# Altium project COM.PrjPcb (part 1 of 2)
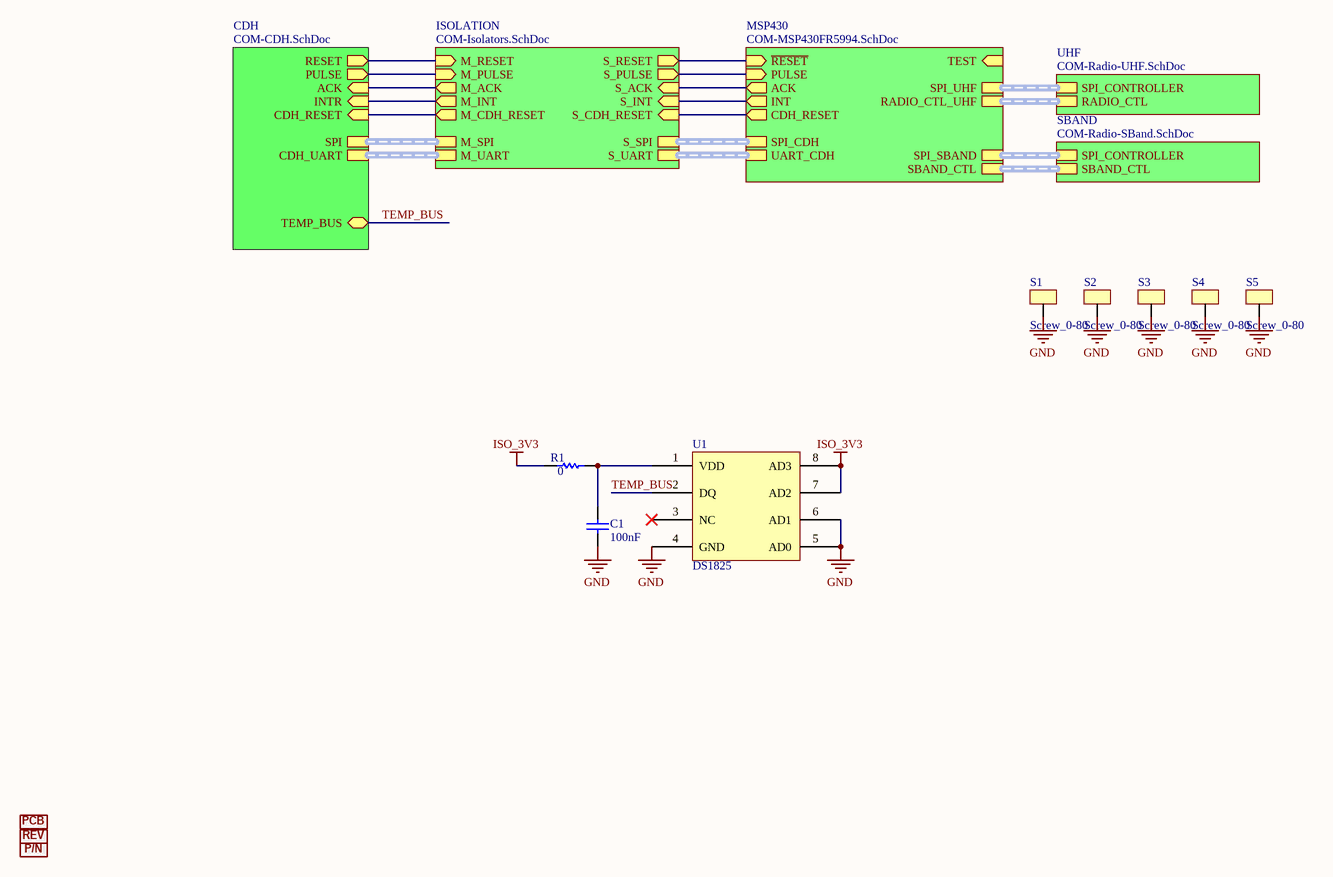
[diagram p0: COM-TopLevel.SchDoc]
BoardName: Cesium 3; Date: June 22nd, 2018; Engineer: Radio Jesus; PartNumber: Ce-137; Revision: A; Version: 1.0
6 sheets, 167 parts. Net scope: hierarchical (ports join the sheet entries above them; power ports are global).
Board file: COM.PcbDoc
Sheets:
  COM-TopLevel.SchDoc
    CDH = COM-CDH.SchDoc
    ISOLATION = COM-Isolators.SchDoc
    SBAND = COM-Radio-SBand.SchDoc
    UHF = COM-Radio-UHF.SchDoc
    MSP430 = COM-MSP430FR5994.SchDoc

## Sheet COM-TopLevel.SchDoc: Top Level
size B; Date: June 22nd, 2018; CompanyName: Lockheed Martin; Engineer: Radio Jesus; Organization: Colorado Space Grant; DocumentNumber: 1; Revision: A; SheetNumber: 1; SheetTotal: 7; ProjectName: COM_Digital.prjpcb

### Parts
C1  Capacitance: 100nF  [1608[0603]]  (hidden comment: C0603C104J3RACAUTO)
INFO1  Info_Board  [Info_Board]  (value not drawn)  (no BOM)
INFO2  Info_Revision  [Info_Revision]  (value not drawn)  (no BOM)
INFO3  Info_PartNumber  [Info_PartNumber]  (value not drawn)  (no BOM)
R1  Resistance: 0  [1608[0603]]  (hidden comment: CRCW06030000Z0EAC)
S1  Screw_0-80  [Screw_0-80]
S2  Screw_0-80  [Screw_0-80]
S3  Screw_0-80  [Screw_0-80]
S4  Screw_0-80  [Screw_0-80]
S5  Screw_0-80  [Screw_0-80]
U1  DS1825  [DS1825]

### Sub-sheets
CDH = COM-CDH.SchDoc: SPI (harness SPI), ACK (in), PULSE (out), CDH_RESET (in), RESET (out), INTR (in), TEMP_BUS (bidir), CDH_UART (harness UART)
ISOLATION = COM-Isolators.SchDoc: M_PULSE (in), M_ACK (out), S_ACK (in), S_PULSE (out), M_SPI (harness SPI_CDH), S_SPI (harness SPI_CDH), M_RESET (in), M_INT (out), S_RESET (out), S_INT (in), M_CDH_RESET (out), S_CDH_RESET (in), M_UART (harness UART), S_UART (harness UART)
MSP430 = COM-MSP430FR5994.SchDoc: UART_CDH (harness UART), SPI_CDH (harness SPI), ACK (out), PULSE (in), INT (out), CDH_RESET (out), SPI_UHF (harness SPI), SPI_SBAND (harness SPI), ~{RESET} (in), TEST (in), RADIO_CTL_UHF (harness UHF_CTL), SBAND_CTL (harness SBAND_CTL)
SBAND = COM-Radio-SBand.SchDoc: SPI_CONTROLLER (harness SPI), SBAND_CTL (harness SBAND_CTL)
UHF = COM-Radio-UHF.SchDoc: SPI_CONTROLLER (harness SPI), RADIO_CTL (harness UHF_CTL)

### Nets
GND: C1.2 S1.1 S2.1 S3.1 S4.1 S5.1 U1.4(GND) U1.5(AD0) U1.6(AD1)
ISO_3V3: R1.1 U1.7(AD2) U1.8(AD3)
M_ACK: sheet CDH/ACK, sheet ISOLATION/M_ACK
M_CDH_RESET: sheet CDH/CDH_RESET, sheet ISOLATION/M_CDH_RESET
M_INT: sheet CDH/INTR, sheet ISOLATION/M_INT
M_PULSE: sheet CDH/PULSE, sheet ISOLATION/M_PULSE
M_RESET: sheet CDH/RESET, sheet ISOLATION/M_RESET
~{RESET}: sheet ISOLATION/S_RESET, sheet MSP430/~{RESET}
S_ACK: sheet ISOLATION/S_ACK, sheet MSP430/ACK
S_CDH_RESET: sheet ISOLATION/S_CDH_RESET, sheet MSP430/CDH_RESET
S_INT: sheet ISOLATION/S_INT, sheet MSP430/INT
S_PULSE: sheet ISOLATION/S_PULSE, sheet MSP430/PULSE
TEMP_BUS: U1.2(DQ) ; sheet CDH/TEMP_BUS
NetC1_1: C1.1 R1.2 U1.1(VDD)

Not connected (* = marked no-connect by the designer): U1 3(NC)*

### Buses and harness runs
harness sheet CDH/CDH_UART = sheet ISOLATION/M_UART
harness sheet CDH/SPI = sheet ISOLATION/M_SPI
harness sheet ISOLATION/S_SPI = sheet MSP430/SPI_CDH
harness sheet ISOLATION/S_UART = sheet MSP430/UART_CDH
harness sheet MSP430/RADIO_CTL_UHF = sheet UHF/RADIO_CTL
harness sheet MSP430/SBAND_CTL = sheet SBAND/SBAND_CTL
harness sheet MSP430/SPI_SBAND = sheet SBAND/SPI_CONTROLLER
harness sheet MSP430/SPI_UHF = sheet UHF/SPI_CONTROLLER

### Notes on the sheet
- Title
- Board
- Date
- Engineer
- Filename
- Sheet
- of
- REV
- (in symbol 27305) PCB
- (in symbol 27306) REV
- (in symbol 27307) P/N

### Library data of the parts
C1 = 4929: MLCC 1608(0603) X7R 100NF 10% 50; PartNumber: CGA2B3X7R1H104K050BB; Manufacturer: TDK; Voltage: 50V; ID: 4929; Category: Ceramic; Status: Unchecked; Tolerance: ±10%; Package: 0402 (1005 Metric); ComponentLink1Description: Datasheet; ComponentLink1URL: http://product.tdk.com/capacitor/mlcc/en/documents/mlcc_automotive_general_en.pdf
INFO1 = 27305: Board Name, Engineer, Date; PartNumber: Board-Info; Manufacturer: COSGC; ID: 27305; Category: Labels; Status: Unchecked; ComponentLink1Description: Datasheet
INFO2 = 27306: Version, Rev, Flight Qualified; PartNumber: Board-Version; Manufacturer: COSGC; ID: 27306; Category: Labels; Status: Unchecked; ComponentLink1Description: Datasheet
INFO3 = 27307: ALL-STAR Part Number; PartNumber: Board-PartNumber; Manufacturer: COSGC; ID: 27307; Category: Labels; Status: Unchecked; ComponentLink1Description: Datasheet
R1 = 3740: RES SMD 0 OHM JUMP 1/10W 0603; PartNumber: CRCW04020000Z0ED; Manufacturer: Vishay; ID: 3740; Power: 0.063W, 1/16W; Tolerance: Jumper; Category: General Purpose; Status: Unchecked; Package: 0402 (1005 Metric); ComponentLink1Description: Datasheet; ComponentLink1URL: http://www.vishay.com/doc?20035
U1 = 27162: IC THERMOMETER DIGITAL 8-USOP; PartNumber: DS1825U+; Manufacturer: Maxim; ID: 27162; Category: Sensors; Status: Unchecked; ComponentLink1Description: Datasheet; ComponentLink1URL: http://datasheets.maximintegrated.com/en/ds/DS1825.pdf

## Sheet COM-CDH.SchDoc: CDH Connector
size B; Date: June 22nd, 2018; CompanyName: Lockheed Martin; Engineer: Radio Jesus; Organization: Colorado Space Grant; DocumentNumber: 4; Revision: A; SheetNumber: 2; SheetTotal: 7; ProjectName: COM_Digital.prjpcb
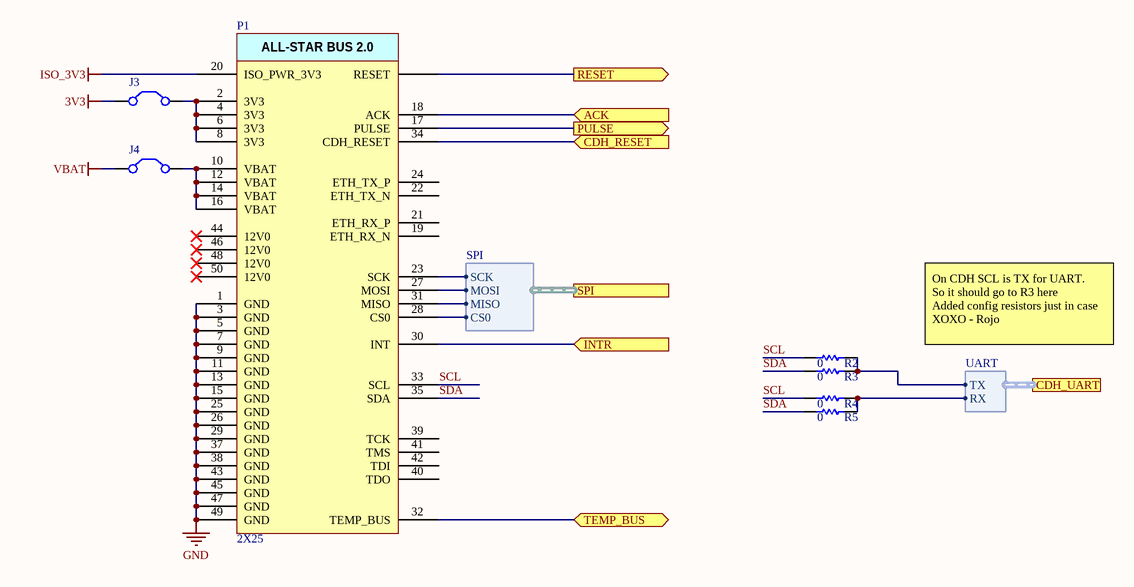
[diagram p1: COM-CDH.SchDoc]

### Parts
J3  Jumper  [C1206]  (value not drawn)
J4  Jumper  [C1206]  (value not drawn)
P1  2X25  [LS2-125-01-X-D-RA1]
R2  Resistance: 0  [1608[0603]]  (hidden comment: CRCW06030000Z0EAC)  (no BOM)
R3  Resistance: 0  [1608[0603]]  (hidden comment: CRCW06030000Z0EAC)
R4  Resistance: 0  [1608[0603]]  (hidden comment: CRCW06030000Z0EAC)
R5  Resistance: 0  [1608[0603]]  (hidden comment: CRCW06030000Z0EAC)  (no BOM)

### Ports
ACK (in), CDH_RESET (in), CDH_UART (harness UART), INTR (in), PULSE (out), RESET (out), SPI (harness SPI), TEMP_BUS (bidir)

### Harnesses
SPI: CS0, MISO, MOSI, SCK
UART: RX, TX

### Nets
3V3: J3.1(C1)
GND: P1.1(GND) P1.3(GND) P1.5(GND) P1.7(GND) P1.9(GND) P1.11(GND) P1.13(GND) P1.15(GND) P1.25(GND) P1.26(GND) P1.29(GND) P1.37(GND) P1.38(GND) P1.43(GND) P1.45(GND) P1.47(GND) P1.49(GND)
ISO_3V3: P1.20(ISO_PWR_3V3)
VBAT: J4.1(C1)
M_ACK: P1.18(ACK) ; port ACK
M_CDH_RESET: P1.34(CDH_RESET) ; port CDH_RESET
M_CS0: P1.28(CS0) ; port SPI.CS0
M_INT: P1.30(INT) ; port INTR
M_MISO: P1.31(MISO) ; port SPI.MISO
M_MOSI: P1.27(MOSI) ; port SPI.MOSI
M_PULSE: P1.17(PULSE) ; port PULSE
M_RESET: P1.36(RESET) ; port RESET
M_RX: R4.2 R5.2 ; port CDH_UART.RX
M_SCK: P1.23(SCK) ; port SPI.SCK
M_TX: R2.2 R3.2 ; port CDH_UART.TX
SCL: P1.33(SCL) R2.1 R4.1
SDA: P1.35(SDA) R3.1 R5.1
TEMP_BUS: P1.32(TEMP_BUS) ; port TEMP_BUS
NetJ3_2: J3.2(C2) P1.2(3V3) P1.4(3V3) P1.6(3V3) P1.8(3V3)
NetJ4_2: J4.2(C2) P1.10(VBAT) P1.12(VBAT) P1.14(VBAT) P1.16(VBAT)

Not connected (* = marked no-connect by the designer): P1 19(ETH_RX_N) 21(ETH_RX_P) 22(ETH_TX_N) 24(ETH_TX_P) 39(TCK) 40(TDO) 41(TMS) 42(TDI) 44(12V0)* 46(12V0)* 48(12V0)* 50(12V0)*

### Notes on the sheet
- On CDH SCL is TX for UART.
  So it should go to R3 here
  Added config resistors just in case
  XOXO - Rojo
- Title
- Board
- Date
- Engineer
- Filename
- Sheet
- of
- REV
- Polar Cube
- (in symbol 4669) ALL-STAR BUS 2.0

### Library data of the parts
J3 J4 = Jumper: Jumper Wire; Published: 24-Mar-1999; LatestRevisionDate: 17-Jul-2002; LatestRevisionNote: Re-released for DXP Platform.; PackageReference: RAD-0.2; Publisher: Altium Limited; PackageDescription: Radial Cap, Thru-Hole; 2 Leads; 0.2 in Pin Spacing
P1 = 4669: 2.00 mm Locking Hermaphroditic Terminal/Socke; Manufacturer: Samtec; ID: 4669; Pitch: 2.00mm; Pins per Row: 25; Rows: 2; PartNumber: LS2-125-01-X-D-RA1; Category: Through-hole; Status: Unchecked; Type: Terminal/Socket; ComponentLink1Description: Datasheet; ComponentLink1URL: http://www.samtec.com/documents/webfiles/cpdf/LS2-1XX-XX-XX-D-XXX-X-MKT.pdf
R2-R5 = 20995: RES SMD 0 OHM JUMP 1/10W 0603; Manufacturer: Vishay; ID: 20995; Power: 0.1W, 1/10W; Tolerance: Jumper; PartNumber: CRCW06030000Z0EA; Category: General Purpose; Status: Unchecked; Package: 0603 (1608 Metric); ComponentLink1Description: Datasheet; ComponentLink1URL: http://www.vishay.com/doc?20035

## Sheet COM-Isolators.SchDoc: CDH-ACS Isolators
size B; Date: June 22nd, 2018; Engineer: Radio Jesus; Organization: Colorado Space Grant; DocumentNumber: 12; Revision: A; SheetNumber: 7; SheetTotal: 7
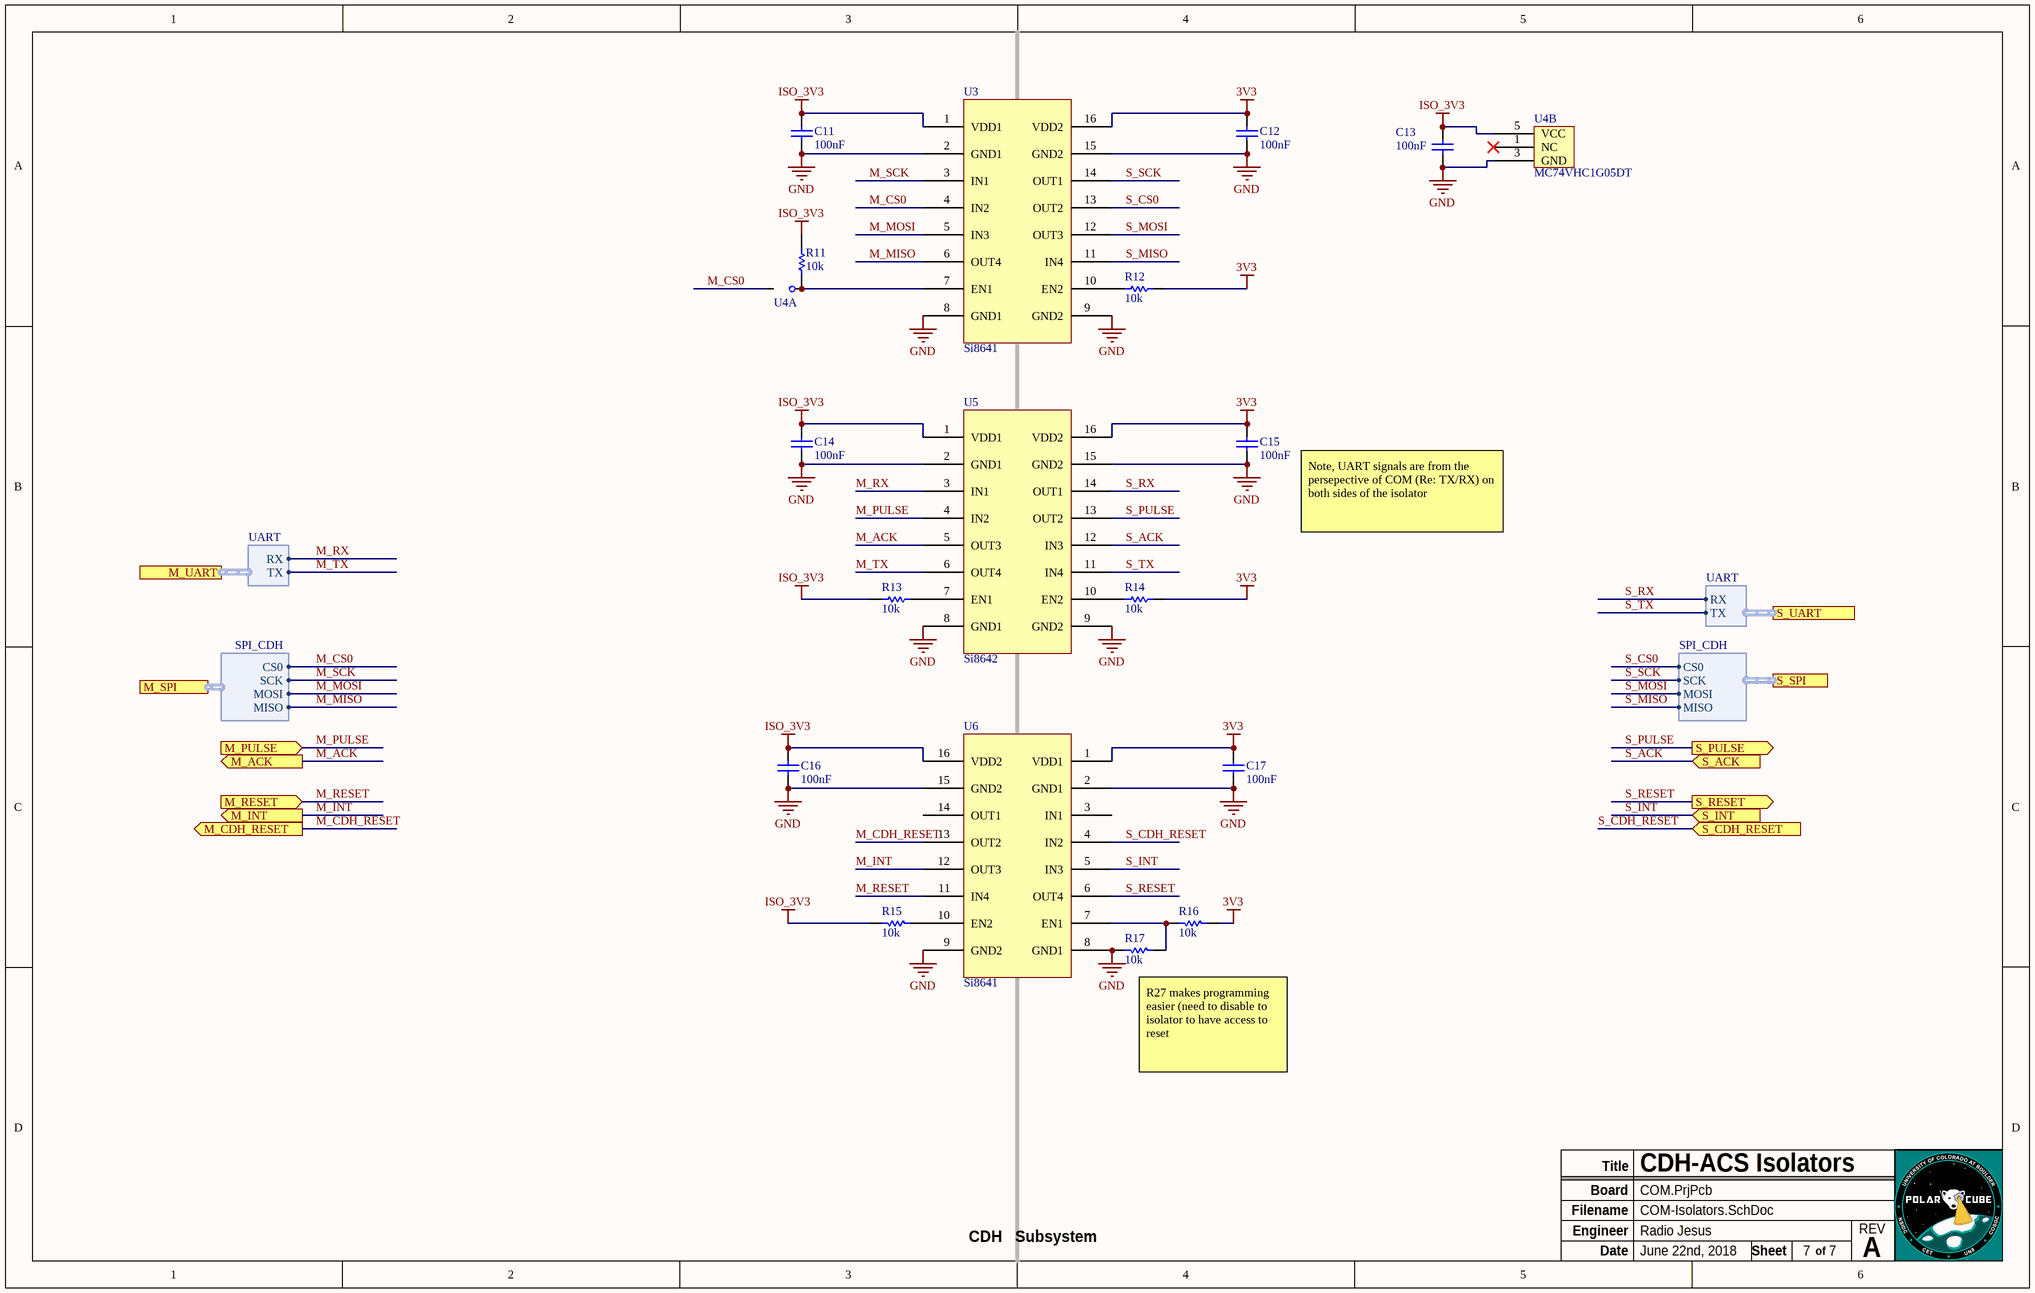
[diagram p2: COM-Isolators.SchDoc]

### Parts
C11  Capacitance: 100nF  [1608[0603]]  (hidden comment: CL10B104KB8ZW6C)
C12  Capacitance: 100nF  [1608[0603]]  (hidden comment: CL10B104KB8ZW6C)
C13  Capacitance: 100nF  [1608[0603]]  (hidden comment: CL10B104KB8ZW6C)
C14  Capacitance: 100nF  [1608[0603]]  (hidden comment: CL10B104KB8ZW6C)
C15  Capacitance: 100nF  [1608[0603]]  (hidden comment: CL10B104KB8ZW6C)
C16  Capacitance: 100nF  [1608[0603]]  (hidden comment: CL10B104KB8ZW6C)
C17  Capacitance: 100nF  [1608[0603]]  (hidden comment: CL10B104KB8ZW6C)
R11  Resistance: 10k  [1608[0603]]  (hidden comment: RMCF0603JG10K0)
R12  Resistance: 10k  [1608[0603]]  (hidden comment: RMCF0603JG10K0)
R13  Resistance: 10k  [1608[0603]]  (hidden comment: RMCF0603JG10K0)
R14  Resistance: 10k  [1608[0603]]  (hidden comment: RMCF0603JG10K0)
R15  Resistance: 10k  [1608[0603]]  (hidden comment: RMCF0603JG10K0)
R16  Resistance: 10k  [1608[0603]]  (hidden comment: RMCF0603JG10K0)  (no BOM)
R17  Resistance: 10k  [1608[0603]]  (hidden comment: RMCF0603JG10K0)
U3  Si8641  [SOP64P600X175-16N]
U4  MC74VHC1G05DT  [TSOP5]  (value not drawn)  (parts A,B of 2)
U5  Si8642  [SOP64P600X175-16N]
U6  Si8641  [SOP64P600X175-16N]

### Ports
M_ACK (out), M_CDH_RESET (out), M_INT (out), M_PULSE (in), M_RESET (in), M_SPI (harness SPI_CDH), M_UART (harness UART), S_ACK (in), S_CDH_RESET (in), S_INT (in), S_PULSE (out), S_RESET (out), S_SPI (harness SPI_CDH), S_UART (harness UART)

### Harnesses
SPI_CDH: CS0, MISO, MOSI, SCK
UART: RX, TX

### Nets
3V3: C12.1 C15.1 C17.1 R12.1 R14.1 R16.2 U3.16(VDD2) U5.16(VDD2) U6.1(VDD1)
GND: C11.2 C12.2 C13.2 C14.2 C15.2 C16.2 C17.2 R17.1 U3.2(GND1) U3.8(GND1) U3.9(GND2) U3.15(GND2) U4.3(GND) U5.2(GND1) U5.8(GND1) U5.9(GND2) U5.15(GND2) U6.2(GND1) U6.8(GND1) U6.9(GND2) U6.15(GND2)
ISO_3V3: C11.1 C13.1 C14.1 C16.1 R11.2 R13.2 R15.2 U3.1(VDD1) U4.5(VCC) U5.1(VDD1) U6.16(VDD2)
M_ACK: U5.5(OUT3) ; port M_ACK
M_CDH_RESET: U6.13(OUT2) ; port M_CDH_RESET
M_CS0: U3.4(IN2) U4.2 ; port M_SPI.CS0
M_INT: U6.12(OUT3) ; port M_INT
M_MISO: U3.6(OUT4) ; port M_SPI.MISO
M_MOSI: U3.5(IN3) ; port M_SPI.MOSI
M_PULSE: U5.4(IN2) ; port M_PULSE
M_RESET: U6.11(IN4) ; port M_RESET
M_RX: U5.3(IN1) ; port M_UART.RX
M_SCK: U3.3(IN1) ; port M_SPI.SCK
M_TX: U5.6(OUT4) ; port M_UART.TX
S_ACK: U5.12(IN3) ; port S_ACK
S_CDH_RESET: U6.4(IN2) ; port S_CDH_RESET
S_CS0: U3.13(OUT2) ; port S_SPI.CS0
S_INT: U6.5(IN3) ; port S_INT
S_MISO: U3.11(IN4) ; port S_SPI.MISO
S_MOSI: U3.12(OUT3) ; port S_SPI.MOSI
S_PULSE: U5.13(OUT2) ; port S_PULSE
S_RESET: U6.6(OUT4) ; port S_RESET  [project net ~{RESET}]
S_RX: U5.14(OUT1) ; port S_UART.RX
S_SCK: U3.14(OUT1) ; port S_SPI.SCK
S_TX: U5.11(IN4) ; port S_UART.TX
NetR11_1: R11.1 U3.7(EN1) U4.4
NetR12_2: R12.2 U3.10(EN2)
NetR13_1: R13.1 U5.7(EN1)
NetR14_2: R14.2 U5.10(EN2)
NetR15_1: R15.1 U6.10(EN2)
NetR16_1: R16.1 R17.2 U6.7(EN1)

Not connected (* = marked no-connect by the designer): U4 1(NC)*; U6 3(IN1) 14(OUT1)

### Notes on the sheet
- Note, UART signals are from the persepective of COM (Re: TX/RX) on both sides of the isolator
- (near R17) R27 makes programming easier (need to disable to isolator to have access to reset
- CDH
- Subsystem
- Title
- Board
- Date
- Engineer
- Filename
- Sheet
- of
- REV

### Library data of the parts
C11-C17 = 5089: MLCC 1608(0603) X7R 100NF 10% 50; PartNumber: CGA3E2X7R1H104K080AE; Manufacturer: TDK; ID: 5089; Category: Ceramic; Status: Unchecked; Tolerance: ±10%; Package: 0603 (1608 Metric); ComponentLink1Description: Datasheet; ComponentLink1URL: http://product.tdk.com/capacitor/mlcc/en/documents/mlcc_automotive_soft_en.pdf
R11-R17 = 20997: 10 kOhms ±5% 0.1W, 1/10W Chip Resistor 0603 (1608 Metric) Automotive AEC-Q200 Thick Film; PartNumber: CRCW060310K0FKEA; Manufacturer: Vishay; ID: 20997; Tolerance: 1%; Category: General Purpose; Status: Unchecked; Power: 0.1W, 1/10W; Package: 0603 (1608 Metric); ComponentLink1Description: Datasheet; ComponentLink1URL: http://www.vishay.com/doc?20035
U3 U6 = Si8641: Low-Power Quad-Channel Digital Isolators; PartNumber: SI8641BA-B-IU; ComponentLink1URL: https://www.silabs.com/Support%20Documents/TechnicalDocs/si864x-datasheet.pdf; ComponentLink1Description: Datasheet
U4 = MC74VHC1G05DT: Manufacturer: ON Semi; ComponentLink1Description: Datasheet; ComponetLink1URL: http://www.onsemi.com/pub_link/Collateral/MC74VHC1G05-D.PDF; PartNumber: MC74VHC1G05DT
U5 = Si8642: Low-Power Quad-Channel Digital Isolators; PartNumber: SI8642BA-B-IU; ComponentLink1URL: https://www.silabs.com/Support%20Documents/TechnicalDocs/si864x-datasheet.pdf; ComponentLink1Description: Datasheet

## Sheet COM-Radio-SBand.SchDoc
size A3
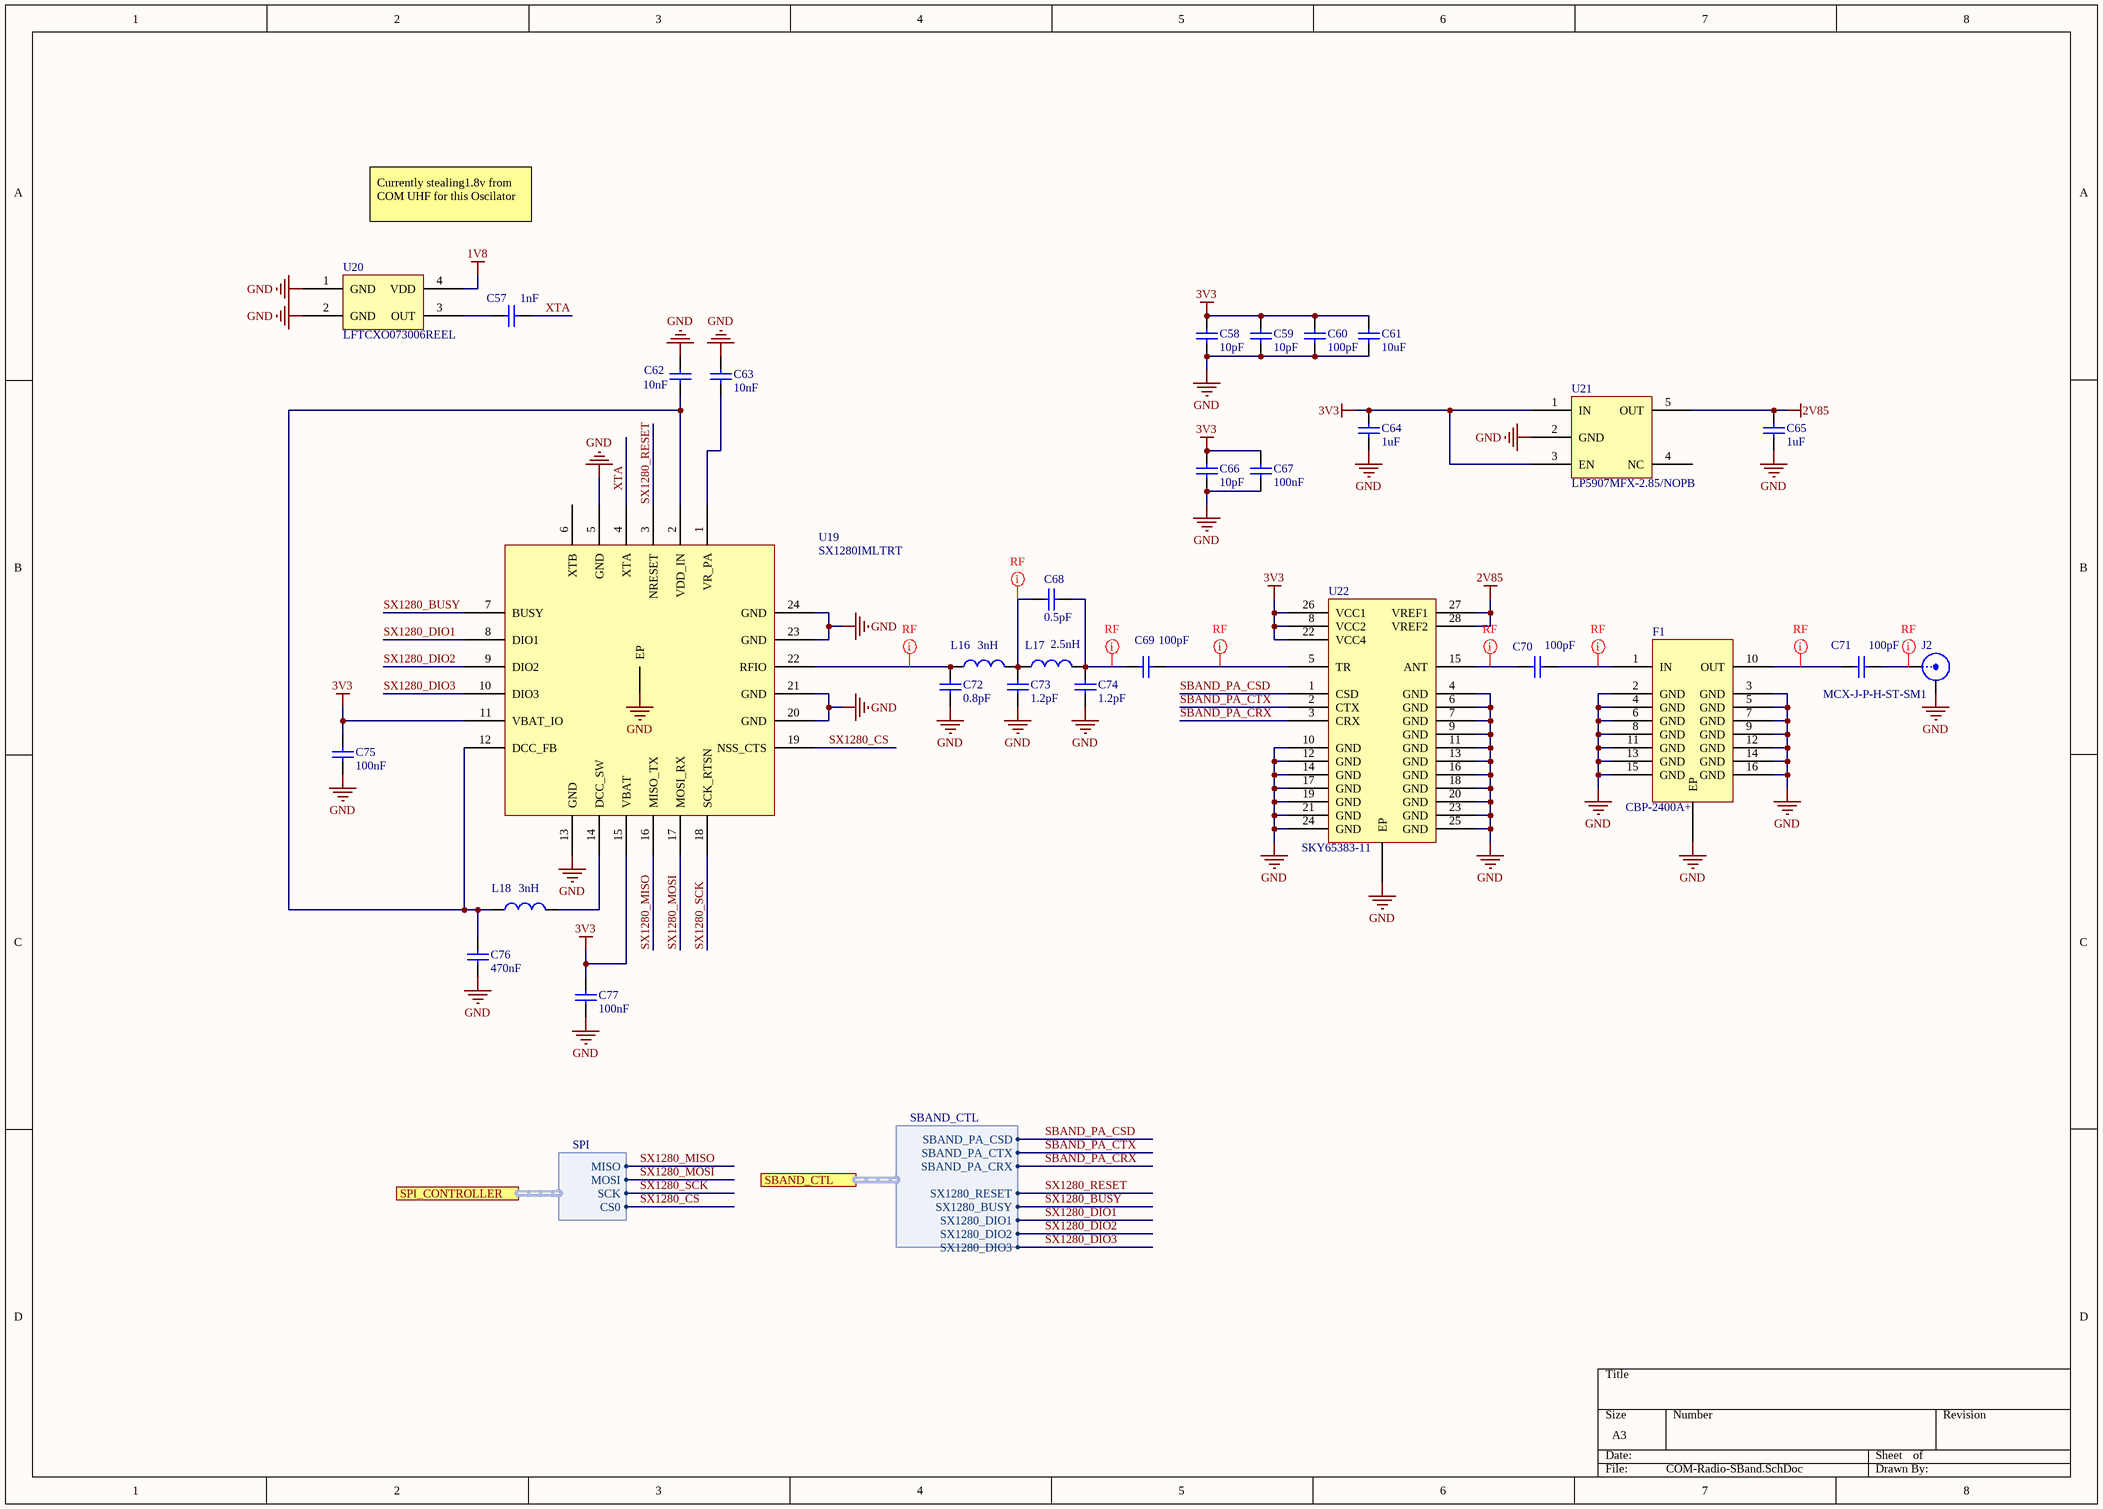
[diagram p3: COM-Radio-SBand.SchDoc]

### Parts
C57  Capacitance: 1nF  [1608[0603]]  (hidden comment: CL10B102KA8NNNC)
C58  Capacitance: 10pF  [1608[0603]]  (hidden comment: CL10C100JB8NCNC)
C59  Capacitance: 10pF  [1608[0603]]  (hidden comment: CL10C100JB8NCNC)
C60  Capacitance: 100pF  [1608[0603]]  (hidden comment: 500R14N101JV4T)
C61  Capacitance: 10uF  [1608[0603]]  (hidden comment: CL10A106MP8NNNC)
C62  Capacitance: 10nF  [1608[0603]]  (hidden comment: CL10B103KB8SFNC)
C63  Capacitance: 10nF  [1608[0603]]  (hidden comment: CL10B103KB8SFNC)
C64  Capacitance: 1uF  [1608[0603]]  (hidden comment: CL10B105MO8NNWC)
C65  Capacitance: 1uF  [1608[0603]]  (hidden comment: CL10B105MO8NNWC)
C66  Capacitance: 10pF  [1608[0603]]  (hidden comment: CL10C100JB8NCNC)
C67  Capacitance: 100nF  [1608[0603]]  (hidden comment: C0603C104J3RACAUTO)
C68  Capacitance: 0.5pF  [1608[0603]]  (hidden comment: CBR06C508B5GAC)
C69  Capacitance: 100pF  [1608[0603]]  (hidden comment: 500R14N101JV4T)
C70  Capacitance: 100pF  [1608[0603]]  (hidden comment: 500R14N101JV4T)
C71  Capacitance: 100pF  [1608[0603]]  (hidden comment: 500R14N101JV4T)
C72  Capacitance: 0.8pF  [1608[0603]]  (hidden comment: CL10C0R8BB8NNNC)
C73  Capacitance: 1.2pF  [1608[0603]]  (hidden comment: CL10C1R2BB8NNNC)
C74  Capacitance: 1.2pF  [1608[0603]]  (hidden comment: CL10C1R2BB8NNNC)
C75  Capacitance: 100nF  [1608[0603]]  (hidden comment: C0603C104J3RACAUTO)
C76  Capacitance: 470nF  [1608[0603]]  (hidden comment: CL10B474KA8NFNC)
C77  Capacitance: 100nF  [1608[0603]]  (hidden comment: C0603C104J3RACAUTO)
F1  CBP-2400A+  [CBP-2400A+]
J2  MCX-J-P-H-ST-SM1  [MCX-J-P-H-ST-SM1]
L16  Inductance: 3nH  [1608[0603]]  (hidden comment: L-14C3N3SV4T)
L17  Inductance: 2.5nH  [1608[0603]]  (hidden comment: LQW18AN2N4C80D)
L18  Inductance: 3nH  [1608[0603]]  (hidden comment: L-14C8N2JV4T)
U19  SX1280IMLTRT  [QFN50P400X400X80_HS-25N]
U20  LFTCXO073006REEL  [LFTCXO073006REEL]
U21  LP5907MFX-2.85/NOPB  [SOT95P280X145-5N]
U22  SKY65383-11  [PQFN70P600X600X85_HS-29N]

### Ports
SBAND_CTL (harness SBAND_CTL), SPI_CONTROLLER (harness SPI)

### Harnesses
SPI: MISO, MOSI, SCK, CS0
SBAND_CTL: SBAND_PA_CSD, SBAND_PA_CTX, SBAND_PA_CRX, SX1280_RESET, SX1280_BUSY, SX1280_DIO1, SX1280_DIO2, SX1280_DIO3

### Nets
1V8: U20.4(VDD)
2V85: C65.2 U21.5(OUT) U22.27(VREF1) U22.28(VREF2)
3V3: C58.2 C59.2 C60.2 C61.2 C64.2 C66.2 C67.2 C75.2 C77.2 U19.11(VBAT_IO) U19.15(VBAT) U21.1(IN) U21.3(EN) U22.8(VCC2) U22.22(VCC4) U22.26(VCC1)
GND: C58.1 C59.1 C60.1 C61.1 C62.2 C63.2 C64.1 C65.1 C66.1 C67.1 C72.1 C73.1 C74.1 C75.1 C76.1 C77.1 F1.2(GND) F1.3(GND) F1.4(GND) F1.5(GND) F1.6(GND) F1.7(GND) F1.8(GND) F1.9(GND) F1.11(GND) F1.12(GND) F1.13(GND) F1.14(GND) F1.15(GND) F1.16(GND) F1.17(EP) J2.2 U19.5(GND) U19.13(GND) U19.20(GND) U19.21(GND) U19.23(GND) U19.24(GND) U19.25(EP) U20.1(GND) U20.2(GND) U21.2(GND) U22.4(GND) U22.6(GND) U22.7(GND) U22.9(GND) U22.10(GND) U22.11(GND) U22.12(GND) U22.13(GND) U22.14(GND) U22.16(GND) U22.17(GND) U22.18(GND) U22.19(GND) U22.20(GND) U22.21(GND) U22.23(GND) U22.24(GND) U22.25(GND) U22.29(EP)
SBAND_PA_CRX: U22.3(CRX) ; port SBAND_CTL.SBAND_PA_CRX
SBAND_PA_CSD: U22.1(CSD) ; port SBAND_CTL.SBAND_PA_CSD
SBAND_PA_CTX: U22.2(CTX) ; port SBAND_CTL.SBAND_PA_CTX
SX1280_BUSY: U19.7(BUSY) ; port SBAND_CTL.SX1280_BUSY
SX1280_CS: U19.19(NSS_CTS) ; port SPI_CONTROLLER.CS0  [project net SPI2_A_CS0_P5_7]
SX1280_DIO1: U19.8(DIO1) ; port SBAND_CTL.SX1280_DIO1
SX1280_DIO2: U19.9(DIO2) ; port SBAND_CTL.SX1280_DIO2
SX1280_DIO3: U19.10(DIO3) ; port SBAND_CTL.SX1280_DIO3
SX1280_MISO: U19.16(MISO_TX) ; port SPI_CONTROLLER.MISO  [project net SPI2_A_MISO_P5_5]
SX1280_MOSI: U19.17(MOSI_RX) ; port SPI_CONTROLLER.MOSI  [project net SPI2_A_MOSI_P5_4]
SX1280_RESET: U19.3(NRESET) ; port SBAND_CTL.SX1280_RESET
SX1280_SCK: U19.18(SCK_RTSN) ; port SPI_CONTROLLER.SCK  [project net SPI2_A_SCK_P5_6]
XTA: C57.1 U19.4(XTA)
NetC57_2: C57.2 U20.3(OUT)
NetC62_1: C62.1 C76.2 L18.2 U19.2(VDD_IN) U19.12(DCC_FB)
NetC63_1: C63.1 U19.1(VR_PA)
NetC68_1: C68.1 C69.2 C74.2 L17.1
NetC68_2: C68.2 C73.2 L16.1 L17.2
NetC69_1: C69.1 U22.5(TR)
NetC70_1: C70.1 U22.15(ANT)
NetC70_2: C70.2 F1.1(IN)
NetC71_1: C71.1 F1.10(OUT)
NetC71_2: C71.2 J2.1
NetC72_2: C72.2 L16.2 U19.22(RFIO)
NetL18_1: L18.1 U19.14(DCC_SW)

Not connected (* = marked no-connect by the designer): U19 6(XTB); U21 4(NC)

### Layout directives
net class RF: NetC68_1, NetC68_2, NetC69_1, NetC70_1, NetC70_2, NetC71_1, NetC71_2, NetC72_2

### Notes on the sheet
- Currently stealing1.8v from COM UHF for this Oscilator

### Library data of the parts
C57 = 27258: CAP CER 1000PF 25V X7R 0603; PartNumber: CBR04C100J5GAC; Manufacturer: Kemet; ID: 27258; Tolerance: 5%; Category: Ceramic; Status: Unchecked; Package: 0402 (1005 Metric); ComponentLink1Description: Datasheet; ComponentLink1URL: http://www.mouser.com/catalog/catalogusd/646/990.pdf
C58 C59 C66 = 27258: CAP CER 10PF 50V C0G/NP0 0603; PartNumber: CBR04C100J5GAC; Manufacturer: Kemet; ID: 27258; Tolerance: 5%; Category: Ceramic; Status: Unchecked; Package: 0402 (1005 Metric); ComponentLink1Description: Datasheet; ComponentLink1URL: http://www.mouser.com/catalog/catalogusd/646/990.pdf
C60 C69 = 27258: CAP CER 100PF 50V C0G/NP0 0603; PartNumber: CBR04C100J5GAC; Manufacturer: Kemet; ID: 27258; Tolerance: 5%; Category: Ceramic; Status: Unchecked; Package: 0402 (1005 Metric); ComponentLink1Description: Datasheet; ComponentLink1URL: http://www.mouser.com/catalog/catalogusd/646/990.pdf
C61 = 27258: CAP CER 10UF 10V X5R 0603; PartNumber: CBR04C100J5GAC; Manufacturer: Kemet; ID: 27258; Tolerance: 5%; Category: Ceramic; Status: Unchecked; Package: 0402 (1005 Metric); ComponentLink1Description: Datasheet; ComponentLink1URL: http://www.mouser.com/catalog/catalogusd/646/990.pdf
C62 C63 = 27258: CAP CER 10000PF 50V X7R 0603; PartNumber: CBR04C100J5GAC; Manufacturer: Kemet; ID: 27258; Tolerance: 5%; Category: Ceramic; Status: Unchecked; Package: 0402 (1005 Metric); ComponentLink1Description: Datasheet; ComponentLink1URL: http://www.mouser.com/catalog/catalogusd/646/990.pdf
C64 C65 = 4997: CAP CER 1UF 16V X7R 0603; PartNumber: CGA2B2X7R1H102M050BA; Manufacturer: TDK; ID: 4997; Tolerance: ±20%; Category: Ceramic; Status: Unchecked; Package: 0402 (1005 Metric); ComponentLink1Description: Datasheet; ComponentLink1URL: http://product.tdk.com/capacitor/mlcc/en/documents/mlcc_automotive_general_en.pdf
C67 C75 C77 = 27258: CAP CER 0.1UF 25V X7R 0603; PartNumber: CBR04C100J5GAC; Manufacturer: Kemet; ID: 27258; Tolerance: 5%; Category: Ceramic; Status: Unchecked; Package: 0402 (1005 Metric); ComponentLink1Description: Datasheet; ComponentLink1URL: http://www.mouser.com/catalog/catalogusd/646/990.pdf
C68 = 27258: CAP CER 0.5PF 50V C0G/NP0 0603; PartNumber: CBR04C100J5GAC; Manufacturer: Kemet; ID: 27258; Tolerance: 5%; Category: Ceramic; Status: Unchecked; Package: 0402 (1005 Metric); ComponentLink1Description: Datasheet; ComponentLink1URL: http://www.mouser.com/catalog/catalogusd/646/990.pdf
C70 C71 = 4997: CAP CER 100PF 50V C0G/NP0 0603; PartNumber: CGA2B2X7R1H102M050BA; Manufacturer: TDK; ID: 4997; Tolerance: ±20%; Category: Ceramic; Status: Unchecked; Package: 0402 (1005 Metric); ComponentLink1Description: Datasheet; ComponentLink1URL: http://product.tdk.com/capacitor/mlcc/en/documents/mlcc_automotive_general_en.pdf
C72 = 27258: CAP CER 0.8PF 50V C0G/NP0 0603; PartNumber: CBR04C100J5GAC; Manufacturer: Kemet; ID: 27258; Tolerance: 5%; Category: Ceramic; Status: Unchecked; Package: 0402 (1005 Metric); ComponentLink1Description: Datasheet; ComponentLink1URL: http://www.mouser.com/catalog/catalogusd/646/990.pdf
C73 C74 = 27258: CAP CER 1.2PF 50V C0G/NP0 0603; PartNumber: CBR04C100J5GAC; Manufacturer: Kemet; ID: 27258; Tolerance: 5%; Category: Ceramic; Status: Unchecked; Package: 0402 (1005 Metric); ComponentLink1Description: Datasheet; ComponentLink1URL: http://www.mouser.com/catalog/catalogusd/646/990.pdf
C76 = 27258: CAP CER 0.47UF 25V X7R 0603; PartNumber: CBR04C100J5GAC; Manufacturer: Kemet; ID: 27258; Tolerance: 5%; Category: Ceramic; Status: Unchecked; Package: 0402 (1005 Metric); ComponentLink1Description: Datasheet; ComponentLink1URL: http://www.mouser.com/catalog/catalogusd/646/990.pdf
F1 = CBP-2400A+: CBP-2400A+ is a ceramic-coaxial-resonator based bandpass filter in a shielded package fabricated using SMT / technology. This filter offers outstanding close-in rejection, low insertion loss and high power handling for use in / mobile satellite, ISM and amateur radio
J2 = MMCX-J-P-H-RA-TH1: MCX Connector Jack, Female Socket 50 Ohm Surface Mount Solder; PartNumber: MMCX-J-P-H-RA-TH1
L16 = 25811: FIXED IND 3.3NH 300MA 200 MOHM; PartNumber: MLG1005SR18JT000; Manufacturer: TDK; ID: 25811; DCR: 3.8 Ohm Max; Current: 150mA; Category: Chip Inductor; Status: Unchecked; Package: 0402 (1005 Metric); ComponentLink1Description: Datasheet; ComponentLink1URL: http://www.tdk.co.jp/tefe02/e521_mlg.pdf
L17 = 25811: FIXED IND 2.4NH 2.4A 26 MOHM SMD; PartNumber: MLG1005SR18JT000; Manufacturer: TDK; ID: 25811; DCR: 3.8 Ohm Max; Current: 150mA; Category: Chip Inductor; Status: Unchecked; Package: 0402 (1005 Metric); ComponentLink1Description: Datasheet; ComponentLink1URL: http://www.tdk.co.jp/tefe02/e521_mlg.pdf
L18 = 25811: FIXED IND 8.2NH 300MA 330 MOHM; PartNumber: MLG1005SR18JT000; Manufacturer: TDK; ID: 25811; DCR: 3.8 Ohm Max; Current: 150mA; Category: Chip Inductor; Status: Unchecked; Package: 0402 (1005 Metric); ComponentLink1Description: Datasheet; ComponentLink1URL: http://www.tdk.co.jp/tefe02/e521_mlg.pdf
U19 = SX1280IMLTRT: IC RF TxRx Only 802.15.4 LoRa™ 2.4GHz 24-WFQFN Exposed Pad
U20 = LFTCXO073006REEL: 50MHz TCXO Clipped Sine Wave Oscillator 2.8 V ~ 3.3 V 4-SMD, No Lead
U21 = LP5907MFX-2.85/NOPB: Linear Voltage Regulator IC 1 Output 250mA SOT-23-5
U22 = SKY65383-11: RF Front End 2.4GHz ~ 2.483 GHz ISM 28-MCM (6x6)

## Sheet COM-Radio-UHF.SchDoc: CDH Connector
size A2; Date: June 22nd, 2018; CompanyName: Lockheed Martin; Engineer: Radio Jesus; Organization: Colorado Space Grant; DocumentNumber: 4; Revision: A; SheetNumber: 6; SheetTotal: 7; ProjectName: COM_Digital.prjpcb
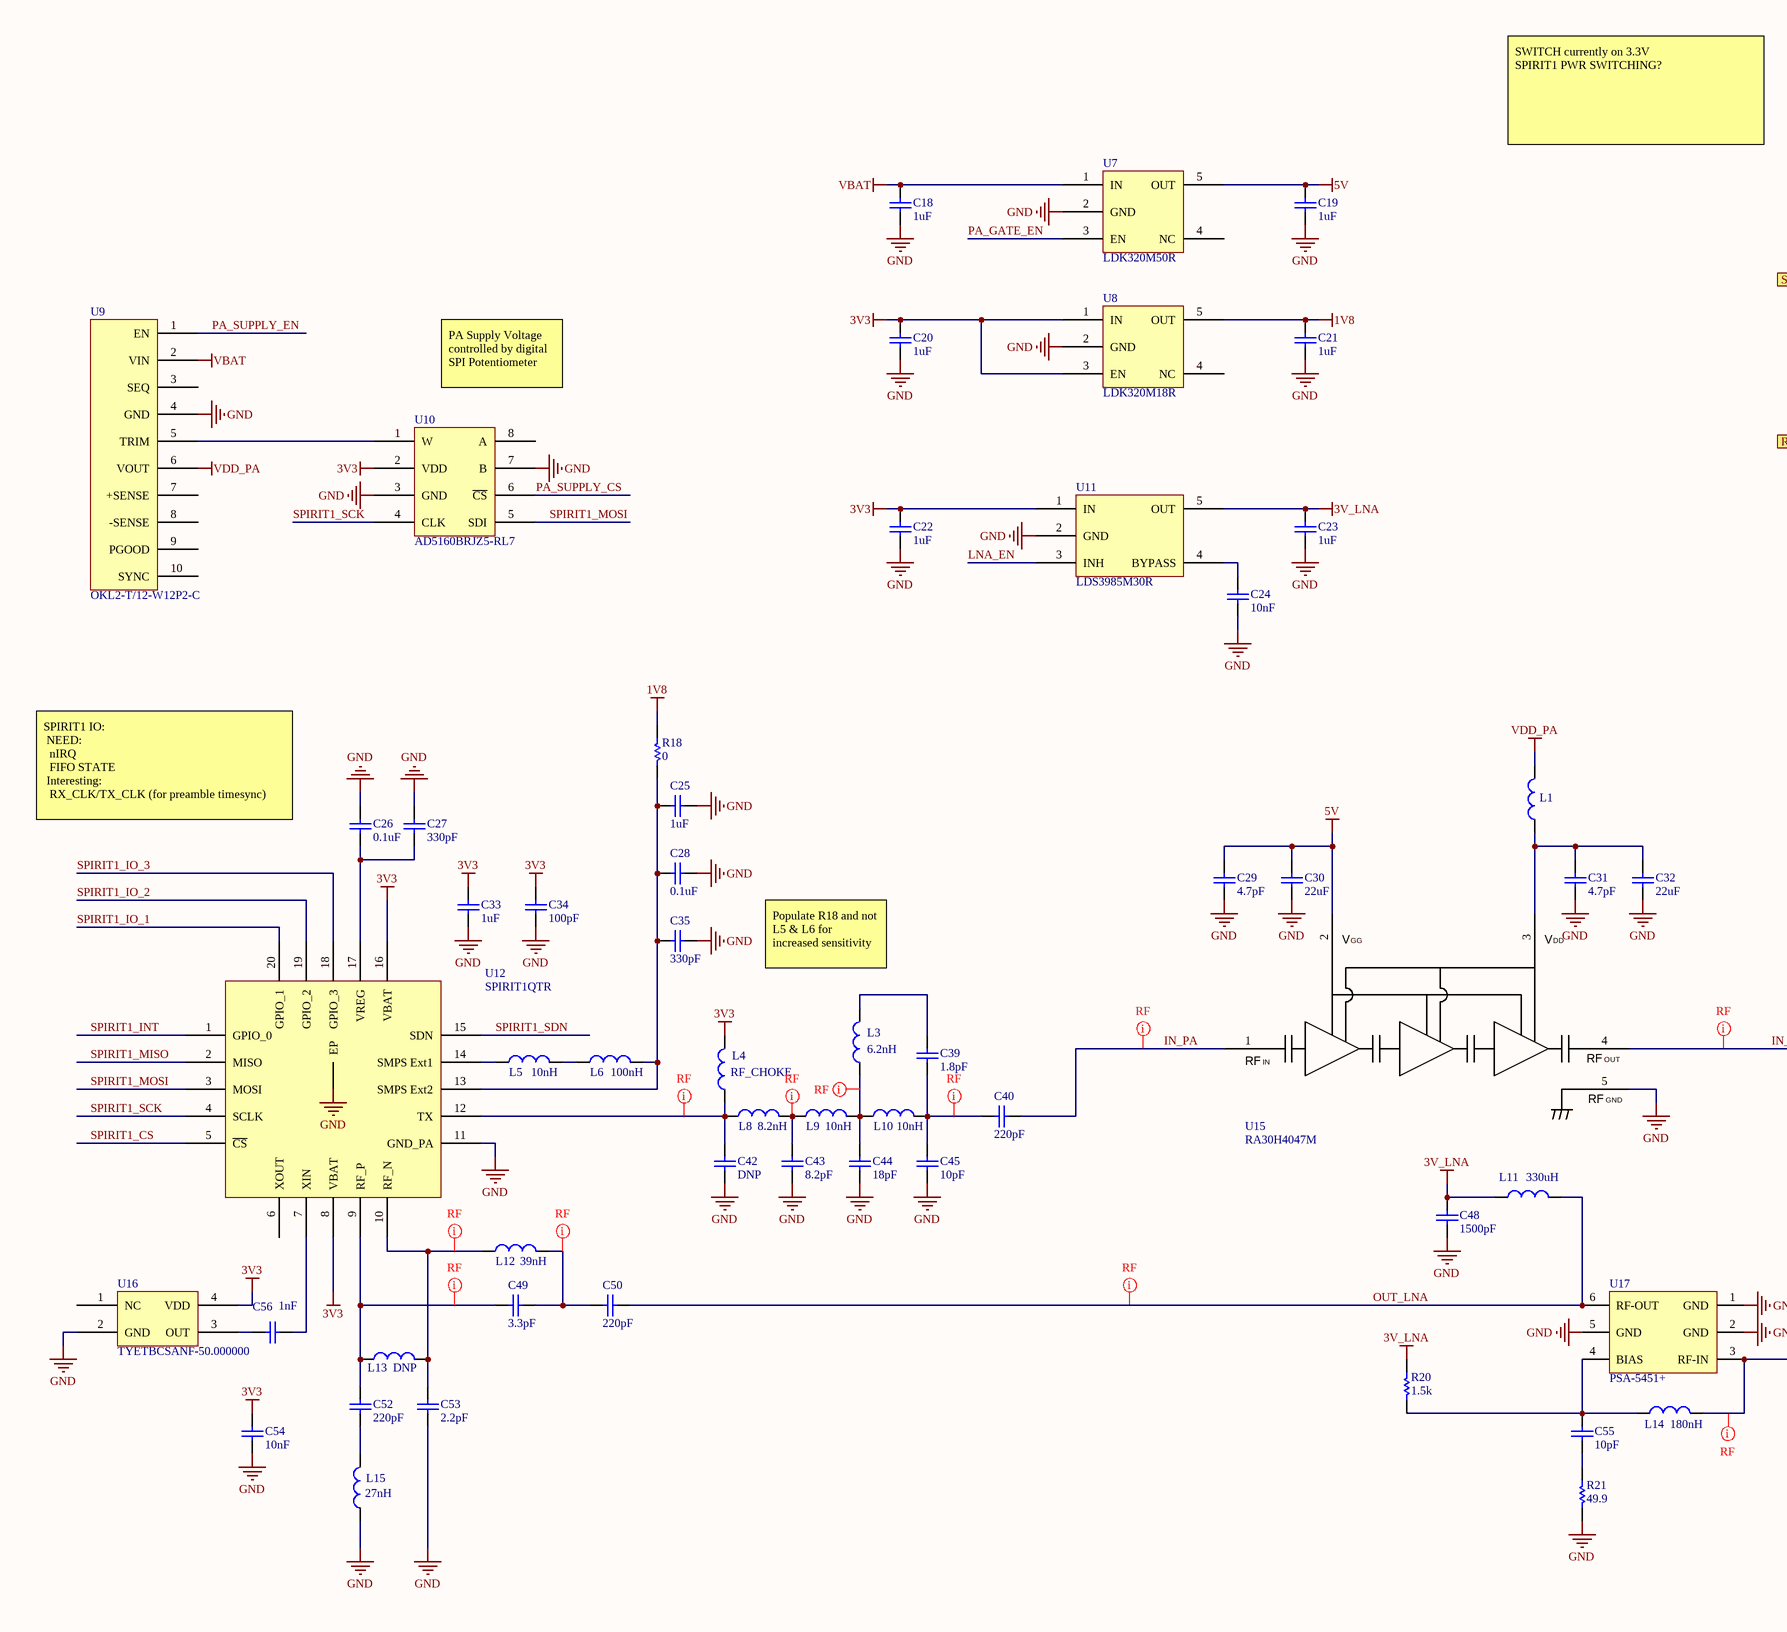
[diagram p4: COM-Radio-UHF.SchDoc, left]
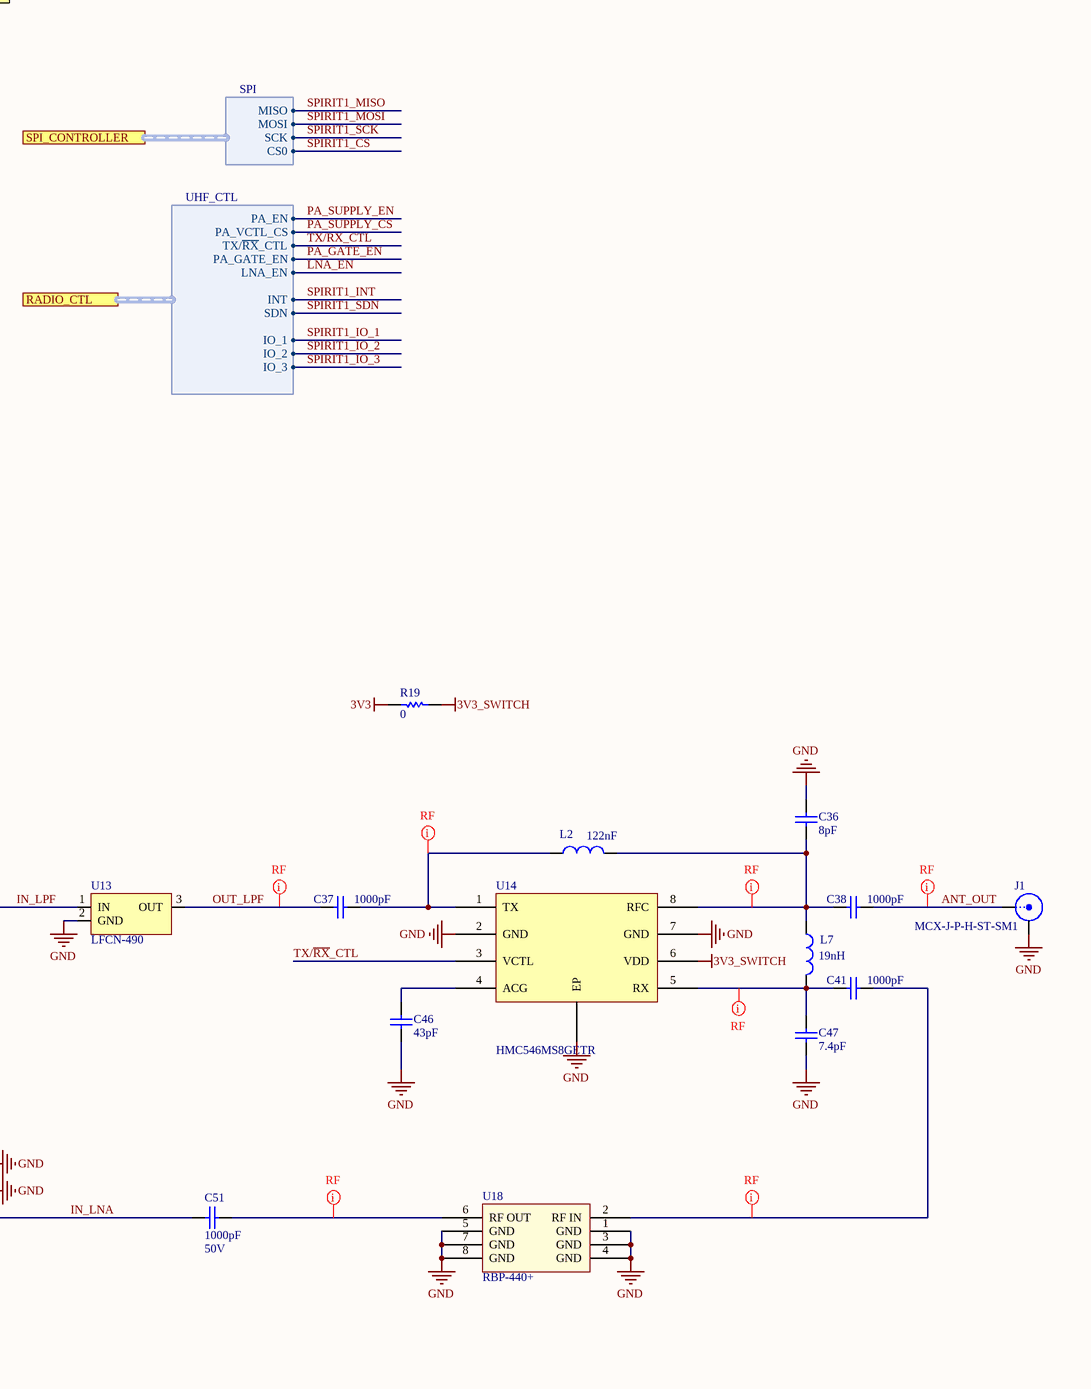
[diagram p5: COM-Radio-UHF.SchDoc, right]

### Parts
C18  Capacitance: 1uF  [1608[0603]]  (hidden comment: CL10B105MO8NNWC)
C19  Capacitance: 1uF  [1608[0603]]  (hidden comment: CL10B105MO8NNWC)
C20  Capacitance: 1uF  [1608[0603]]  (hidden comment: CL10B105MO8NNWC)
C21  Capacitance: 1uF  [1608[0603]]  (hidden comment: CL10B105MO8NNWC)
C22  Capacitance: 1uF  [1608[0603]]  (hidden comment: CL10B105MO8NNWC)
C23  Capacitance: 1uF  [1608[0603]]  (hidden comment: CL10B105MO8NNWC)
C24  Capacitance: 10nF  [1608[0603]]  (hidden comment: CL10B103KO8NNNC)
C25  Capacitance: 1uF  [1608[0603]]  (hidden comment: CL10B105MO8NNWC)
C26  Capacitance: 0.1uF  [1608[0603]]  (hidden comment: CL10B104KB8ZW6C)
C27  Capacitance: 330pF  [1608[0603]]  (hidden comment: CL10C331JB8NFNC)
C28  Capacitance: 0.1uF  [1608[0603]]  (hidden comment: CL10B104KB8ZW6C)
C29  Capacitance: 4.7pF  [1608[0603]]  (hidden comment: CL10C4R7BB8NNNC)
C30  Capacitance: 22uF  [C1210_M]  (hidden comment: C3225X5R1C226M250AA)
C31  Capacitance: 4.7pF  [1608[0603]]  (hidden comment: CL10C4R7BB8NNNC)
C32  Capacitance: 22uF  [C1210_M]  (hidden comment: C3225X5R1C226M250AA)
C33  Capacitance: 1uF  [1608[0603]]  (hidden comment: CL10B105MO8NNWC)
C34  Capacitance: 100pF  [1608[0603]]  (hidden comment: C0603C101K5GACTU)
C35  Capacitance: 330pF  [1608[0603]]  (hidden comment: CL10B331JB8NNNC)
C36  Capacitance: 8pF  [1608[0603]]  (hidden comment: CL10C080CB8NNNC)
C37  Capacitance: 1000pF  [1608[0603]]  (hidden comment: C0603X102J5GAC7867)
C38  Capacitance: 1000pF  [1608[0603]]  (hidden comment: C0603X102J5GAC7867)
C39  Capacitance: 1.8pF  [1608[0603]]  (hidden comment: CL10C1R8BB8NNNC)
C40  Capacitance: 220pF  [1608[0603]]  (hidden comment: CL10C221JB8NNNC)
C41  Capacitance: 1000pF  [1608[0603]]  (hidden comment: C0603X102J5GAC7867)
C42  Capacitance: DNP  [1608[0603]]  (hidden comment: Cap)
C43  Capacitance: 8.2pF  [1608[0603]]  (hidden comment: CL10C8R2DB8NNNC)
C44  Capacitance: 18pF  [1608[0603]]  (hidden comment: C0603C180K5GACTU)
C45  Capacitance: 10pF  [1608[0603]]  (hidden comment: CL10C100JB8NCNC)
C46  Capacitance: 43pF  [1608[0603]]  (hidden comment: C0603C430J5GACTU)
C47  Capacitance: 7.4pF  [1608[0603]]  (hidden comment: CBR06C749B5GAC)
C48  Capacitance: 1500pF  [1608[0603]]  (hidden comment: C0603C152J5GACTU)
C49  Capacitance: 3.3pF  [1608[0603]]  (hidden comment: 06035A3R3BAT2A)
C50  Capacitance: 220pF  [1608[0603]]  (hidden comment: CL10C221JB8NNNC)
C51  Capacitance: 1000pF  Voltage: 50V  [1608[0603]]  (hidden comment: C0603X102J5GAC7867)
C52  Capacitance: 220pF  [1608[0603]]  (hidden comment: CL10C221JB8NNNC)
C53  Capacitance: 2.2pF  [1608[0603]]  (hidden comment: C0603C229B5GAC7867)
C54  Capacitance: 10nF  [1608[0603]]  (hidden comment: Cap)
C55  Capacitance: 10pF  [1608[0603]]  (hidden comment: CL10C100JB8NCNC)
C56  Capacitance: 1nF  [1608[0603]]  (hidden comment: CL10B102KA8NNNC)
J1  MCX-J-P-H-ST-SM1  [MCX-J-P-H-ST-SM1]
L1  SDR2207-4R7ML  [SDR2207-4R7ML]  (value not drawn)
L2  Inductance: 122nF  [1608[0603]]  (hidden comment: PE-0603CD121GTT)
L3  Inductance: 6.2nH  [1608[0603]]  (hidden comment: LQG18HH6N2S00D)
L4  Type: RF_CHOKE  [6-0805_M]  (hidden comment: LQM21FN100M80L)
L5  Inductance: 10nH  [1608[0603]]  (hidden comment: L-14C10NJV4T)
L6  Inductance: 100nH  [1608[0603]]  (hidden comment: HK1608R10J-T)
L7  Inductance: 19nH  [1608[0603]]  (hidden comment: LQW18AN19NJ8ZD)
L8  Inductance: 8.2nH  [1608[0603]]  (hidden comment: L-14C8N2JV4T)
L9  Inductance: 10nH  [1608[0603]]  (hidden comment: L-14C10NJV4T)
L10  Inductance: 10nH  [1608[0603]]  (hidden comment: L-14C10NJV4T)
L11  Inductance: 330uH  [1608[0603]]  (hidden comment: SRR7045-331M)
L12  Inductance: 39nH  [1608[0603]]  (hidden comment: L-14C39NJV4T)
L13  DNP  [1608[0603]]
L14  Inductance: 180nH  [1608[0603]]  (hidden comment: CIH10TR18JNC)
L15  Inductance: 27nH  [1608[0603]]  (hidden comment: L-14C27NJV4T)
R18  Resistance: 0  [1608[0603]]  (hidden comment: CRCW06030000Z0EAC)
R19  Resistance: 0  [1608[0603]]  (hidden comment: CRCW06030000Z0EAC)
R20  Resistance: 1.5k  [1608[0603]]  (hidden comment: CRG0603F1K5)
R21  Resistance: 49.9  [1608[0603]]  (hidden comment: ERJ-3EKF49R9V)
U7  LDK320M50R  [SOT95P280X145-5N]
U8  LDK320M18R  [SOT95P280X145-5N]
U9  OKL2-T/12-W12P2-C  [OKL2-T/12-W12P2-C]
U10  AD5160BRJZ5-RL7  [TSOP65P280X130-8N]
U11  LDS3985M30R  [SOT95P280X145-5N]
U12  SPIRIT1QTR  [QFN50P400X400X100_HS-21N]
U13  LFCN-490  [LFCN-490]
U14  HMC546MS8GETR  [TSOP65P490X110_HS-9N]
U15  RA30H4047M  [RA30H4047M_BRD_MNT]
U16  TYETBCSANF-50.000000  [TYETBCSANF]
U17  PSA-5451+  [SOT65P215X100-6N]
U18  RBP-440+  [RBP-440+]

### Ports
RADIO_CTL (harness UHF_CTL), SPI_CONTROLLER (harness SPI)

### Harnesses
SPI: MISO, MOSI, SCK, CS0
UHF_CTL: PA_EN, PA_VCTL_CS, TX/~{RX}_CTL, INT, SDN, IO_1, IO_2, IO_3, PA_GATE_EN, LNA_EN

### Nets
1V8: C21.2 R18.1 U8.5(OUT)
3V3: C20.2 C22.2 C33.2 C34.2 C54.2 L4.1 R19.2 U8.1(IN) U8.3(EN) U10.2(VDD) U11.1(IN) U12.8(VBAT) U12.16(VBAT) U16.4(VDD)
3V3_SWITCH: R19.1 U14.6(VDD)
3V_LNA: C23.2 C48.2 L11.2 R20.2 U11.5(OUT)
5V: C19.2 C29.2 C30.2 U7.5(OUT) U15.2(VGG)
GND: C18.1 C19.1 C20.1 C21.1 C22.1 C23.1 C24.1 C25.1 C26.2 C27.2 C28.1 C29.1 C30.1 C31.1 C32.1 C33.1 C34.1 C35.2 C36.2 C42.1 C43.1 C44.1 C45.1 C46.1 C47.1 C48.1 C53.1 C54.1 J1.2 L15.2 R21.2 U7.2(GND) U8.2(GND) U9.4(GND) U10.3(GND) U10.7(B) U11.2(GND) U12.11(GND_PA) U12.21(EP) U13.2(GND) U14.2(GND) U14.7(GND) U14.9(EP) U15.5(POUT) U16.2(GND) U17.1(GND) U17.2(GND) U17.5(GND) U18.1(GND) U18.3(GND) U18.4(GND) U18.5(GND) U18.7(GND) U18.8(GND)
VBAT: C18.2 U7.1(IN) U9.2(VIN)
VDD_PA: L1.1 U9.6(VOUT)
ANT_OUT: C38.2 J1.1
IN_LNA: C51.2 L14.1 U17.3(RF-IN)
IN_LPF: U13.1(IN) U15.4(POUT)
IN_PA: C40.1 U15.1(PIN)
LNA_EN: U11.3(INH) ; port RADIO_CTL.LNA_EN
OUT_LNA: C50.1 L11.1 U17.6(RF-OUT)
OUT_LPF: C37.1 U13.3(OUT)
PA_GATE_EN: U7.3(EN) ; port RADIO_CTL.PA_GATE_EN
PA_SUPPLY_CS: U10.6(~{CS}) ; port RADIO_CTL.PA_VCTL_CS
PA_SUPPLY_EN: U9.1(EN) ; port RADIO_CTL.PA_EN
SPIRIT1_CS: U12.5(~{CS}) ; port SPI_CONTROLLER.CS0  [project net SPI1_B_CS0_P5_3]
SPIRIT1_INT: U12.1(GPIO_0) ; port RADIO_CTL.INT
SPIRIT1_IO_1: U12.20(GPIO_1) ; port RADIO_CTL.IO_1
SPIRIT1_IO_2: U12.19(GPIO_2) ; port RADIO_CTL.IO_2
SPIRIT1_IO_3: U12.18(GPIO_3) ; port RADIO_CTL.IO_3
SPIRIT1_MISO: U12.2(MISO) ; port SPI_CONTROLLER.MISO  [project net SPI1_B_MISO_P5_1]
SPIRIT1_MOSI: U10.5(SDI) U12.3(MOSI) ; port SPI_CONTROLLER.MOSI  [project net SPI1_B_MOSI_P5_0]
SPIRIT1_SCK: U10.4(CLK) U12.4(SCLK) ; port SPI_CONTROLLER.SCK  [project net SPI1_B_SCK_P5_2]
SPIRIT1_SDN: U12.15(SDN) ; port RADIO_CTL.SDN
TX/~{RX}_CTL: U14.3(VCTL) ; port RADIO_CTL.TX/~{RX}_CTL
NetC24_2: C24.2 U11.4(BYPASS)
NetC25_2: C25.2 C28.2 C35.1 L6.1 R18.2 U12.13(SMPS_Ext2)
NetC26_1: C26.1 C27.1 U12.17(VREG)
NetC31_2: C31.2 C32.2 L1.2 U15.3(VDD)
NetC36_1: C36.1 C38.1 L2.1 L7.2 U14.8(RFC)
NetC37_2: C37.2 L2.2 U14.1(TX)
NetC39_1: C39.1 C40.2 C45.2 L10.1
NetC39_2: C39.2 L3.1
NetC41_1: C41.1 C47.2 L7.1 U14.5(RX)
NetC41_2: C41.2 U18.2(RF_IN)
NetC42_2: C42.2 L4.2 L8.2 U12.12(TX)
NetC43_2: C43.2 L8.1 L9.2
NetC44_2: C44.2 L3.2 L9.1 L10.2
NetC46_2: C46.2 U14.4(ACG)
NetC49_1: C49.1 C50.2 L12.1
NetC49_2: C49.2 C52.2 L13.2 U12.9(RF_P)
NetC51_1: C51.1 U18.6(RF_OUT)
NetC52_1: C52.1 L15.1
NetC53_2: C53.2 L12.2 L13.1 U12.10(RF_N)
NetC55_1: C55.1 R21.1
NetC55_2: C55.2 L14.2 R20.1 U17.4(BIAS)
NetC56_1: C56.1 U12.7(XIN)
NetC56_2: C56.2 U16.3(OUT)
NetL5_1: L5.1 L6.2
NetL5_2: L5.2 U12.14(SMPS_Ext1)
NetU9_5: U9.5(TRIM) U10.1(W)

Not connected (* = marked no-connect by the designer): U7 4(NC); U8 4(NC); U9 3(SEQ) 7(+SENSE) 8(-SENSE) 9(PGOOD) 10(SYNC); U10 8(A); U12 6(XOUT); U16 1(NC)

### Layout directives
net class RF: ANT_OUT, IN_LNA, IN_LPF, IN_PA, NetC36_1, NetC37_2, NetC39_1, NetC41_1, NetC41_2, NetC42_2, NetC43_2, NetC44_2, NetC49_1, NetC49_2, NetC51_1, NetC53_2, OUT_LNA, OUT_LPF

### Notes on the sheet
- SWITCH currently on 3.3V
  SPIRIT1 PWR SWITCHING?
- PA Supply Voltage controlled by digital SPI Potentiometer
- SPIRIT1 IO:
  NEED:
  nIRQ
  FIFO STATE
  Interesting:
  RX_CLK/TX_CLK (for preamble timesync)
- Populate R18 and not L5 & L6 for increased sensitivity
- Title
- Size:
- Date:
- File:
- A2
- Number:
- Time:
- Revision:
- Sheet
- of
- (in symbol RA30H4047M) V; GG; DD; OUT; RF; IN; GND

### Library data of the parts
C18-C23 = 4997: as C64 on sheet COM-Radio-SBand; Category: Ceramic; Status: Unchecked; Package: 0402 (1005 Metric); ComponentLink1Description: Datasheet; ComponentLink1URL: http://product.tdk.com/capacitor/mlcc/en/documents/mlcc_automotive_general_en.pdf
C24 = 4997: CAP CER 10000PF 16V X7R 0603; PartNumber: CGA2B2X7R1H102M050BA; Manufacturer: TDK; ID: 4997; Tolerance: ±20%; Category: Ceramic; Status: Unchecked; Package: 0402 (1005 Metric); ComponentLink1Description: Datasheet; ComponentLink1URL: http://product.tdk.com/capacitor/mlcc/en/documents/mlcc_automotive_general_en.pdf
C25 C33 = 27258: CAP CER 1UF 16V X7R 0603; PartNumber: CBR04C100J5GAC; Manufacturer: Kemet; ID: 27258; Tolerance: 5%; Category: Ceramic; Status: Unchecked; Package: 0402 (1005 Metric); ComponentLink1Description: Datasheet; ComponentLink1URL: http://www.mouser.com/catalog/catalogusd/646/990.pdf
C26 C28 = 27258: MLCC 1608(0603) X7R 100NF 10% 50; PartNumber: CBR04C100J5GAC; Manufacturer: Kemet; ID: 27258; Tolerance: 5%; Category: Ceramic; Status: Unchecked; Package: 0402 (1005 Metric); ComponentLink1Description: Datasheet; ComponentLink1URL: http://www.mouser.com/catalog/catalogusd/646/990.pdf
C27 = 27258: CAP CER 330PF 50V C0G/NP0 0603; PartNumber: CBR04C100J5GAC; Manufacturer: Kemet; ID: 27258; Tolerance: 5%; Category: Ceramic; Status: Unchecked; Package: 0402 (1005 Metric); ComponentLink1Description: Datasheet; ComponentLink1URL: http://www.mouser.com/catalog/catalogusd/646/990.pdf
C29 C31 = 4997: CAP CER 4.7PF 50V C0G/NP0 0603; PartNumber: CGA2B2X7R1H102M050BA; Manufacturer: TDK; ID: 4997; Tolerance: ±20%; Category: Ceramic; Status: Unchecked; Package: 0402 (1005 Metric); ComponentLink1Description: Datasheet; ComponentLink1URL: http://product.tdk.com/capacitor/mlcc/en/documents/mlcc_automotive_general_en.pdf
C30 C32 = 4997: CAP CER 22UF 16V X5R 1210; PartNumber: CGA2B2X7R1H102M050BA; Manufacturer: TDK; ID: 4997; Tolerance: ±20%; Category: Ceramic; Status: Unchecked; Package: 0402 (1005 Metric); ComponentLink1Description: Datasheet; ComponentLink1URL: http://product.tdk.com/capacitor/mlcc/en/documents/mlcc_automotive_general_en.pdf
C34 = 27258: as C60 on sheet COM-Radio-SBand; Category: Ceramic; Status: Unchecked; Package: 0402 (1005 Metric); ComponentLink1Description: Datasheet; ComponentLink1URL: http://www.mouser.com/catalog/catalogusd/646/990.pdf
C35 = 27258: CAP CER 330PF 50V X7R 0603; PartNumber: CBR04C100J5GAC; Manufacturer: Kemet; ID: 27258; Tolerance: 5%; Category: Ceramic; Status: Unchecked; Package: 0402 (1005 Metric); ComponentLink1Description: Datasheet; ComponentLink1URL: http://www.mouser.com/catalog/catalogusd/646/990.pdf
C36 = 4997: CAP CER 8PF 50V C0G/NP0 0603; PartNumber: CGA2B2X7R1H102M050BA; Manufacturer: TDK; ID: 4997; Tolerance: ±20%; Category: Ceramic; Status: Unchecked; Package: 0402 (1005 Metric); ComponentLink1Description: Datasheet; ComponentLink1URL: http://product.tdk.com/capacitor/mlcc/en/documents/mlcc_automotive_general_en.pdf
C37 C38 C41 C51 = 4997: CAP CER 1000PF 50V C0G/NP0 0603; PartNumber: CGA2B2X7R1H102M050BA; Manufacturer: TDK; ID: 4997; Tolerance: ±20%; Category: Ceramic; Status: Unchecked; Package: 0402 (1005 Metric); ComponentLink1Description: Datasheet; ComponentLink1URL: http://product.tdk.com/capacitor/mlcc/en/documents/mlcc_automotive_general_en.pdf
C39 = 27258: CAP CER 1.8PF 50V C0G/NP0 0603; PartNumber: CBR04C100J5GAC; Manufacturer: Kemet; ID: 27258; Tolerance: 5%; Category: Ceramic; Status: Unchecked; Package: 0402 (1005 Metric); ComponentLink1Description: Datasheet; ComponentLink1URL: http://www.mouser.com/catalog/catalogusd/646/990.pdf
C40 C50 C52 = 27258: CAP CER 220PF 50V C0G/NP0 0603; PartNumber: CBR04C100J5GAC; Manufacturer: Kemet; ID: 27258; Tolerance: 5%; Category: Ceramic; Status: Unchecked; Package: 0402 (1005 Metric); ComponentLink1Description: Datasheet; ComponentLink1URL: http://www.mouser.com/catalog/catalogusd/646/990.pdf
C42 C54 = 27258: RF Microwave MLCCs; PartNumber: CBR04C100J5GAC; Manufacturer: Kemet; ID: 27258; Tolerance: 5%; Category: Ceramic; Status: Unchecked; Package: 0402 (1005 Metric); ComponentLink1Description: Datasheet; ComponentLink1URL: http://www.mouser.com/catalog/catalogusd/646/990.pdf
C43 = 27258: CAP CER 8.2PF 50V C0G/NP0 0603; PartNumber: CBR04C100J5GAC; Manufacturer: Kemet; ID: 27258; Tolerance: 5%; Category: Ceramic; Status: Unchecked; Package: 0402 (1005 Metric); ComponentLink1Description: Datasheet; ComponentLink1URL: http://www.mouser.com/catalog/catalogusd/646/990.pdf
C44 = 27258: CAP CER 18PF 50V C0G/NP0 0603; PartNumber: CBR04C100J5GAC; Manufacturer: Kemet; ID: 27258; Tolerance: 5%; Category: Ceramic; Status: Unchecked; Package: 0402 (1005 Metric); ComponentLink1Description: Datasheet; ComponentLink1URL: http://www.mouser.com/catalog/catalogusd/646/990.pdf
C45 C55 = 27258: as C58 on sheet COM-Radio-SBand; Category: Ceramic; Status: Unchecked; Package: 0402 (1005 Metric); ComponentLink1Description: Datasheet; ComponentLink1URL: http://www.mouser.com/catalog/catalogusd/646/990.pdf
C46 = 4997: CAP CER 43PF 50V C0G/NP0 0603; PartNumber: CGA2B2X7R1H102M050BA; Manufacturer: TDK; ID: 4997; Tolerance: ±20%; Category: Ceramic; Status: Unchecked; Package: 0402 (1005 Metric); ComponentLink1Description: Datasheet; ComponentLink1URL: http://product.tdk.com/capacitor/mlcc/en/documents/mlcc_automotive_general_en.pdf
C47 = 4997: CAP CER RF 7.4PF 50V +/-0.1 PF C; PartNumber: CGA2B2X7R1H102M050BA; Manufacturer: TDK; ID: 4997; Tolerance: ±20%; Category: Ceramic; Status: Unchecked; Package: 0402 (1005 Metric); ComponentLink1Description: Datasheet; ComponentLink1URL: http://product.tdk.com/capacitor/mlcc/en/documents/mlcc_automotive_general_en.pdf
C48 = 4997: CAP CER 1500PF 50V C0G/NP0 0603; PartNumber: CGA2B2X7R1H102M050BA; Manufacturer: TDK; ID: 4997; Tolerance: ±20%; Category: Ceramic; Status: Unchecked; Package: 0402 (1005 Metric); ComponentLink1Description: Datasheet; ComponentLink1URL: http://product.tdk.com/capacitor/mlcc/en/documents/mlcc_automotive_general_en.pdf
C49 = 27258: CAP CER 3.3PF 50V C0G/NP0 0603; PartNumber: CBR04C100J5GAC; Manufacturer: Kemet; ID: 27258; Tolerance: 5%; Category: Ceramic; Status: Unchecked; Package: 0402 (1005 Metric); ComponentLink1Description: Datasheet; ComponentLink1URL: http://www.mouser.com/catalog/catalogusd/646/990.pdf
C53 = 27258: CAP CER 2.2PF 50V NP0 0603; PartNumber: CBR04C100J5GAC; Manufacturer: Kemet; ID: 27258; Tolerance: 5%; Category: Ceramic; Status: Unchecked; Package: 0402 (1005 Metric); ComponentLink1Description: Datasheet; ComponentLink1URL: http://www.mouser.com/catalog/catalogusd/646/990.pdf
C56 = 27258: as C57 on sheet COM-Radio-SBand; Category: Ceramic; Status: Unchecked; Package: 0402 (1005 Metric); ComponentLink1Description: Datasheet; ComponentLink1URL: http://www.mouser.com/catalog/catalogusd/646/990.pdf
J1 = MMCX-J-P-H-RA-TH1: as J2 on sheet COM-Radio-SBand; PartNumber: MMCX-J-P-H-RA-TH1
L1 = 25811: FIXED IND 4.7UH 8.5A 8.8 MOHM; PartNumber: MLG1005SR18JT000; Manufacturer: TDK; ID: 25811; DCR: 3.8 Ohm Max; Current: 150mA; Inductance: 4.7uH; Category: Chip Inductor; Status: Unchecked; Package: 0402 (1005 Metric); ComponentLink1Description: Datasheet; ComponentLink1URL: http://www.tdk.co.jp/tefe02/e521_mlg.pdf
L2 = 25811: FIXED IND 122NH 300MA 650 MOHM; PartNumber: MLG1005SR18JT000; Manufacturer: TDK; ID: 25811; DCR: 3.8 Ohm Max; Current: 150mA; Category: Chip Inductor; Status: Unchecked; Package: 0402 (1005 Metric); ComponentLink1Description: Datasheet; ComponentLink1URL: http://www.tdk.co.jp/tefe02/e521_mlg.pdf
L3 = 25811: FIXED IND 6.2NH 430MA 200 MOHM; PartNumber: MLG1005SR18JT000; Manufacturer: TDK; ID: 25811; DCR: 3.8 Ohm Max; Current: 150mA; Category: Chip Inductor; Status: Unchecked; Package: 0402 (1005 Metric); ComponentLink1Description: Datasheet; ComponentLink1URL: http://www.tdk.co.jp/tefe02/e521_mlg.pdf
L4 = 25811: FIXED IND 10UH 100MA 300 MOHM; PartNumber: MLG1005SR18JT000; Manufacturer: TDK; ID: 25811; DCR: 3.8 Ohm Max; Current: 150mA; Inductance: 10uH; Category: Chip Inductor; Status: Unchecked; Package: 0402 (1005 Metric); ComponentLink1Description: Datasheet; ComponentLink1URL: http://www.tdk.co.jp/tefe02/e521_mlg.pdf
L5 L9 L10 = 25811: FIXED IND 10NH 300MA 350 MOHM; PartNumber: MLG1005SR18JT000; Manufacturer: TDK; ID: 25811; DCR: 3.8 Ohm Max; Current: 150mA; Category: Chip Inductor; Status: Unchecked; Package: 0402 (1005 Metric); ComponentLink1Description: Datasheet; ComponentLink1URL: http://www.tdk.co.jp/tefe02/e521_mlg.pdf
L6 = 25811: FIXED IND 100NH 300MA 100 MOHM; PartNumber: MLG1005SR18JT000; Manufacturer: TDK; ID: 25811; DCR: 3.8 Ohm Max; Current: 150mA; Category: Chip Inductor; Status: Unchecked; Package: 0402 (1005 Metric); ComponentLink1Description: Datasheet; ComponentLink1URL: http://www.tdk.co.jp/tefe02/e521_mlg.pdf
L7 = 25811: FIXED IND 19NH 1.4A 75 MOHM; PartNumber: MLG1005SR18JT000; Manufacturer: TDK; ID: 25811; DCR: 3.8 Ohm Max; Current: 150mA; Category: Chip Inductor; Status: Unchecked; Package: 0402 (1005 Metric); ComponentLink1Description: Datasheet; ComponentLink1URL: http://www.tdk.co.jp/tefe02/e521_mlg.pdf
L8 = 25811: as L18 on sheet COM-Radio-SBand; Category: Chip Inductor; Status: Unchecked; Package: 0402 (1005 Metric); ComponentLink1Description: Datasheet; ComponentLink1URL: http://www.tdk.co.jp/tefe02/e521_mlg.pdf
L11 = 25811: FIXED IND 330UH 400MA 730 MOHM; PartNumber: MLG1005SR18JT000; Manufacturer: TDK; ID: 25811; DCR: 3.8 Ohm Max; Current: 150mA; Category: Chip Inductor; Status: Unchecked; Package: 0402 (1005 Metric); ComponentLink1Description: Datasheet; ComponentLink1URL: http://www.tdk.co.jp/tefe02/e521_mlg.pdf
L12 = 25811: FIXED IND 39NH 300MA 700 MOHM; PartNumber: MLG1005SR18JT000; Manufacturer: TDK; ID: 25811; DCR: 3.8 Ohm Max; Current: 150mA; Category: Chip Inductor; Status: Unchecked; Package: 0402 (1005 Metric); ComponentLink1Description: Datasheet; ComponentLink1URL: http://www.tdk.co.jp/tefe02/e521_mlg.pdf
L13 = 25811: PartNumber: MLG1005SR18JT000; Manufacturer: TDK; Inductance: 180nH; ID: 25811; DCR: 3.8 Ohm Max; Current: 150mA; Category: Chip Inductor; Status: Unchecked; Package: 0402 (1005 Metric); ComponentLink1Description: Datasheet; ComponentLink1URL: http://www.tdk.co.jp/tefe02/e521_mlg.pdf
L14 = 25811: FIXED IND 180NH 250MA 1.3 OHM; PartNumber: MLG1005SR18JT000; Manufacturer: TDK; ID: 25811; DCR: 3.8 Ohm Max; Current: 150mA; Category: Chip Inductor; Status: Unchecked; Package: 0402 (1005 Metric); ComponentLink1Description: Datasheet; ComponentLink1URL: http://www.tdk.co.jp/tefe02/e521_mlg.pdf
L15 = 25811: FIXED IND 27NH 300MA 600 MOHM; PartNumber: MLG1005SR18JT000; Manufacturer: TDK; ID: 25811; DCR: 3.8 Ohm Max; Current: 150mA; Category: Chip Inductor; Status: Unchecked; Package: 0402 (1005 Metric); ComponentLink1Description: Datasheet; ComponentLink1URL: http://www.tdk.co.jp/tefe02/e521_mlg.pdf
R18 = 4641: RES SMD 0 OHM JUMP 1/10W 0603; PartNumber: CRCW040249R9FKED; Manufacturer: Vishay; ID: 4641; Power: 0.063W, 1/16W; Tolerance: ±1%; Category: General Purpose; Status: Unchecked; Package: 0402 (1005 Metric); ComponentLink1Description: Datasheet; ComponentLink1URL: http://www.vishay.com/doc?20035
R19 = 3863: RES SMD 0 OHM JUMP 1/10W 0603; PartNumber: CRCW04021K50FKED; Manufacturer: Vishay; ID: 3863; Power: 0.063W, 1/16W; Tolerance: ±1%; Category: General Purpose; Status: Unchecked; Package: 0402 (1005 Metric); ComponentLink1Description: Datasheet; ComponentLink1URL: http://www.vishay.com/doc?20035
R20 = 3863: RES SMD 1.5K OHM 1% 1/10W 0603; PartNumber: CRCW04021K50FKED; Manufacturer: Vishay; ID: 3863; Power: 0.063W, 1/16W; Category: General Purpose; Status: Unchecked; Tolerance: ±1%; Package: 0402 (1005 Metric); ComponentLink1Description: Datasheet; ComponentLink1URL: http://www.vishay.com/doc?20035
R21 = 4641: RES SMD 49.9 OHM 1% 1/10W 0603; PartNumber: CRCW040249R9FKED; Manufacturer: Vishay; ID: 4641; Power: 0.063W, 1/16W; Category: General Purpose; Status: Unchecked; Tolerance: ±1%; Package: 0402 (1005 Metric); ComponentLink1Description: Datasheet; ComponentLink1URL: http://www.vishay.com/doc?20035
U7 = LDK320M50R: Linear Voltage Regulator IC Positive Fixed 1 Output 5V 200mA SOT-23-5
U8 = LDK320M18R: Linear Voltage Regulator IC Positive Fixed 1 Output 1.8V 200mA SOT-23-5
U9 = OKL2-T/12-W12P2-C: Non-Isolated PoL Module DC DC Converter 1 Output 0.69 ~ 5.5 V 12A 4.5V - 14V Input
U10 = AD5160BRJZ5-RL7: Digital Potentiometer 5k Ohm 1 Circuit 256 Taps SPI Interface SOT-23-8
U11 = LDS3985M30R: Linear Voltage Regulator IC Positive Fixed 1 Output 3V 300mA SOT-23-5
U12 = SPIRIT1QTR: IC RF TxRx Only General ISM < 1GHz 150MHz ~ 174MHz, 300MHz ~ 348MHz, 387MHz ~ 470MHz, 779MHz ~ 956MHz 20-VFQFN Exposed Pad
U13 = 28619: Low Pass Filter with knee at 490MHz; Manufacturer: Mini Circuits; ID: 28619; Param1: Band Pass; Param2: Surface Mount; Param3: 0-6.2GHz; PartNumber: LFCN-490; Category: Filters; Status: Unchecked; ComponentLink1Description: Datasheet; ComponentLink1URL: http://www.minicircuits.com/pdfs/LFCN-490.pdf
U14 = HMC546MS8GETR: RF Switch IC Cellular SPDT 2.2GHz 50 Ohm 8-MSOP
U15 = RA30H4047M: The RA30H4047M is a 30-watt RF MOSFET Amplifier / Module for 12.5-volt mobile radios that operate in the 400- to / 470-MHz range.
U16 = TYETBCSANF-50.000000: 50MHz TCXO Clipped Sine Wave Oscillator 2.8 V ~ 3.3 V 4-SMD, No Lead
U17 = 27278: LNA, DC-4GHz, 29dBm IP3; Manufacturer: Mini Circuits; ID: 27278; Param1: 1; PartNumber: PSA-5451+; Category: Amplifiers; Status: Unchecked; ComponentLink1Description: Datasheet; ComponentLink1URL: http://www.minicircuits.com/pdfs/PSA-5451+.pdf
U18 = 27277: RF Filter,0.5W; Manufacturer: Mini Circuits; ID: 27277; Param1: BPF; Param2: SMT; Param3: 440Mhz; Param4: 50 Ohms; PartNumber: RBP-440+; Category: Filters; Status: Unchecked; ComponentLink1Description: Datasheet; ComponentLink1URL: http://www.minicircuits.com/pdfs/RBP-440+.pdf